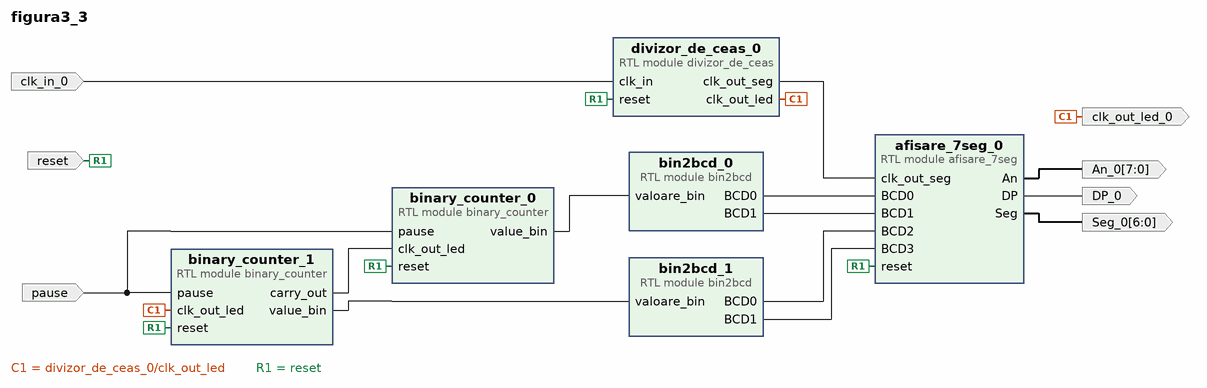
[diagram p0: block diagram of the top level]
# Vivado block design figura3_3, xc7a100tcsg324-1, Vivado 2022.2
create_bd_design figura3_3

create_bd_port -dir I pause
create_bd_port -dir I -type rst reset
create_bd_port -dir O clk_out_led_0
create_bd_port -dir I clk_in_0
create_bd_port -dir O -from 7 -to 0 An_0
create_bd_port -dir O DP_0
create_bd_port -dir O -from 6 -to 0 Seg_0

create_bd_cell -type module -reference bin2bcd bin2bcd_0
create_bd_cell -type module -reference bin2bcd bin2bcd_1
create_bd_cell -type module -reference divizor_de_ceas divizor_de_ceas_0
create_bd_cell -type module -reference binary_counter binary_counter_0
create_bd_cell -type module -reference binary_counter binary_counter_1
create_bd_cell -type module -reference afisare_7seg afisare_7seg_0

# ---- connections ----

connect_bd_net [get_bd_pins afisare_7seg_0/An] [get_bd_ports An_0]
connect_bd_net [get_bd_pins afisare_7seg_0/DP] [get_bd_ports DP_0]
connect_bd_net [get_bd_pins afisare_7seg_0/Seg] [get_bd_ports Seg_0]
connect_bd_net [get_bd_pins bin2bcd_0/BCD0] [get_bd_pins afisare_7seg_0/BCD0]
connect_bd_net [get_bd_pins bin2bcd_0/BCD1] [get_bd_pins afisare_7seg_0/BCD1]
connect_bd_net [get_bd_pins bin2bcd_1/BCD0] [get_bd_pins afisare_7seg_0/BCD2]
connect_bd_net [get_bd_pins bin2bcd_1/BCD1] [get_bd_pins afisare_7seg_0/BCD3]
connect_bd_net [get_bd_pins binary_counter_0/value_bin] [get_bd_pins bin2bcd_0/valoare_bin]
connect_bd_net [get_bd_pins binary_counter_1/carry_out] [get_bd_pins binary_counter_0/clk_out_led]
connect_bd_net [get_bd_pins binary_counter_1/value_bin] [get_bd_pins bin2bcd_1/valoare_bin]
connect_bd_net -net clk_in_0_1 [get_bd_ports clk_in_0] [get_bd_pins divizor_de_ceas_0/clk_in]
connect_bd_net [get_bd_pins divizor_de_ceas_0/clk_out_led] [get_bd_ports clk_out_led_0] [get_bd_pins binary_counter_1/clk_out_led]
connect_bd_net [get_bd_pins divizor_de_ceas_0/clk_out_seg] [get_bd_pins afisare_7seg_0/clk_out_seg]
connect_bd_net -net pause_0_1 [get_bd_ports pause] [get_bd_pins binary_counter_0/pause] [get_bd_pins binary_counter_1/pause]
connect_bd_net [get_bd_ports reset] \
  [get_bd_pins divizor_de_ceas_0/reset] [get_bd_pins binary_counter_0/reset] [get_bd_pins binary_counter_1/reset] \
  [get_bd_pins afisare_7seg_0/reset]

validate_bd_design
save_bd_design
